# EAGLE design SatUplink-v11 (EAGLE 5.10)
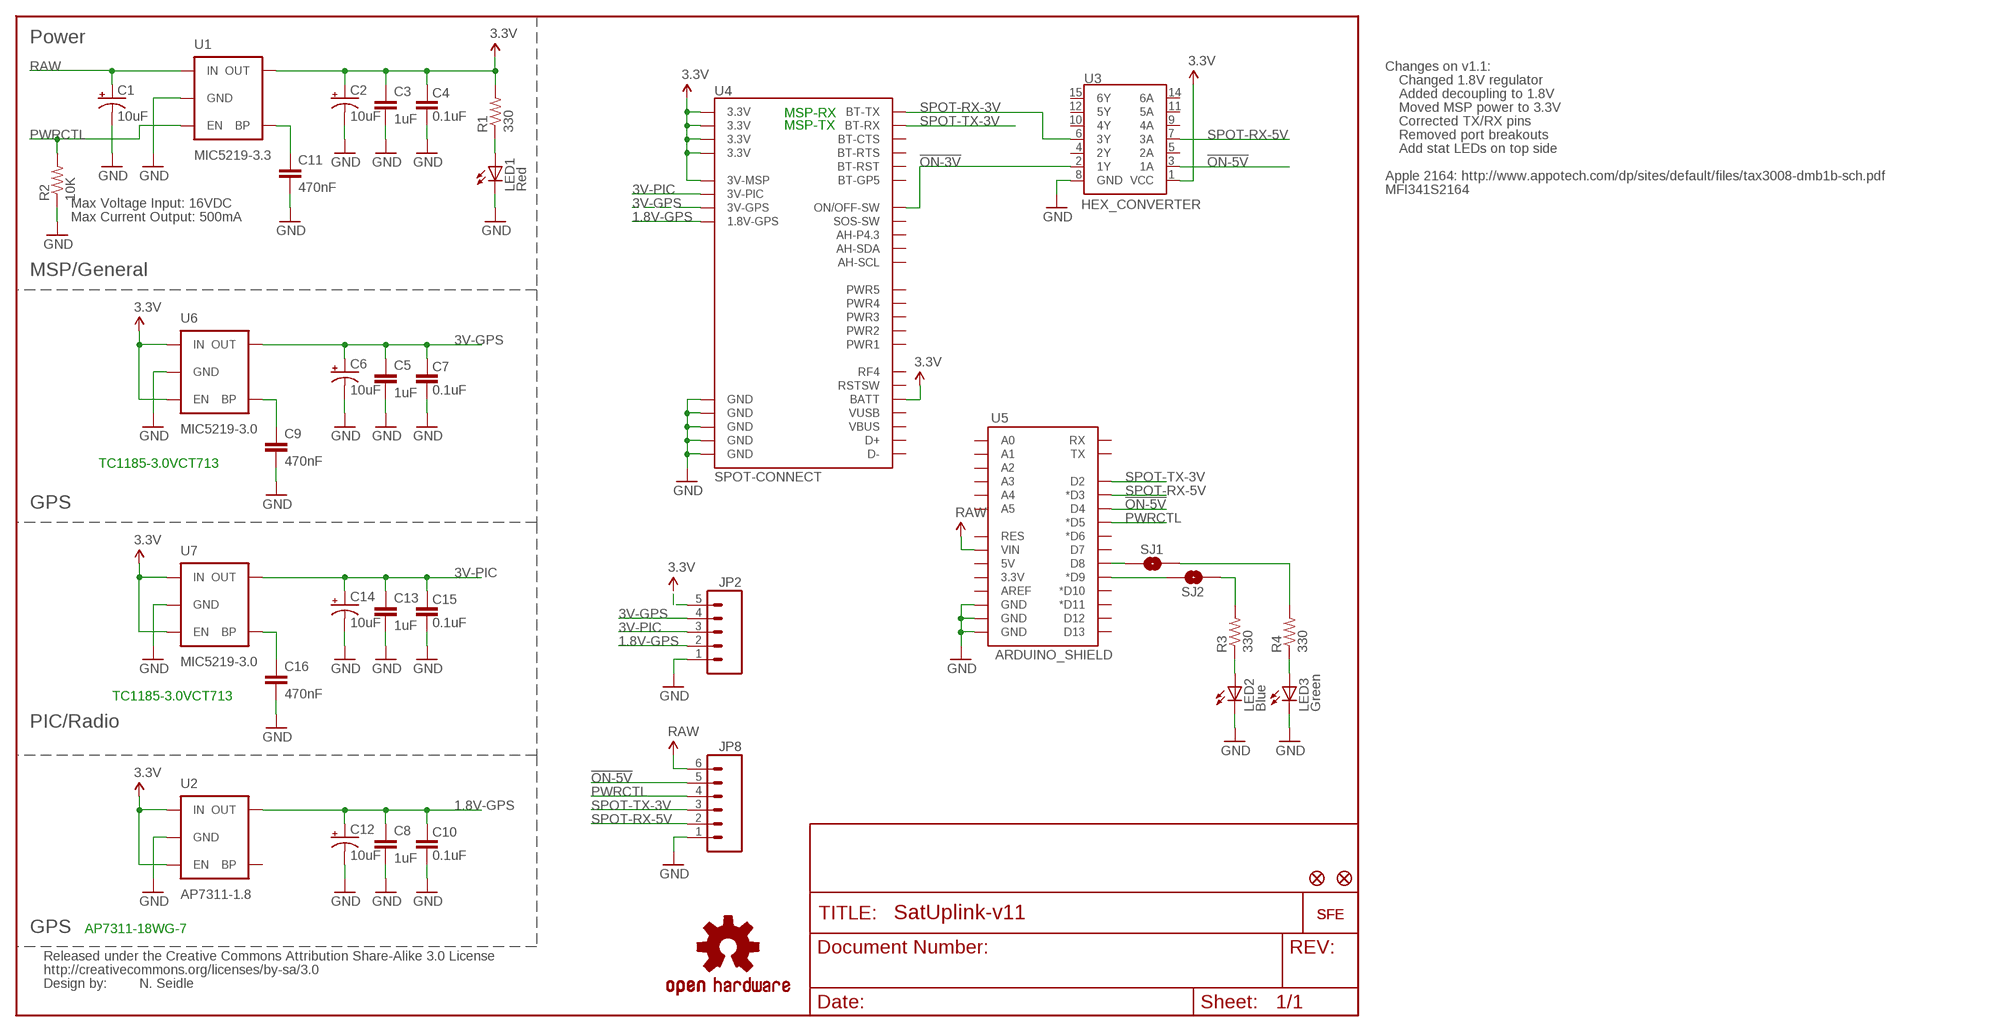
[diagram p0: schematic, sheet 1]

## Parts
C1  10uF  CAP_POL1206  [EIA3216]
C2  10uF  CAP_POL1206  [EIA3216]
C3  1uF  CAP0402-CAP  [0402-CAP]
C4  0.1uF  CAP0402-CAP  [0402-CAP]
C5  1uF  CAP0402-CAP  [0402-CAP]
C6  10uF  CAP_POL1206  [EIA3216]
C7  0.1uF  CAP0402-CAP  [0402-CAP]
C8  1uF  CAP0402-CAP  [0402-CAP]
C9  470nF  CAP0402-CAP  [0402-CAP]
C10  0.1uF  CAP0402-CAP  [0402-CAP]
C11  470nF  CAP0402-CAP  [0402-CAP]
C12  10uF  CAP_POL1206  [EIA3216]
C13  1uF  CAP0402-CAP  [0402-CAP]
C14  10uF  CAP_POL1206  [EIA3216]
C15  0.1uF  CAP0402-CAP  [0402-CAP]
C16  470nF  CAP0402-CAP  [0402-CAP]
JP2  M05PTH  [1X05]
JP8  M06SIP  [1X06]
JP10  FIDUCIALUFIDUCIAL  [MICRO-FIDUCIAL]
JP11  FIDUCIALUFIDUCIAL  [MICRO-FIDUCIAL]
LED1  Red  LED0603  [LED-0603]
LED2  Blue  LED0603  [LED-0603]
LED3  Green  LED0603  [LED-0603]
R1  330  RESISTOR0402-RES  [0402-RES]
R2  10K  RESISTOR0402-RES  [0402-RES]
R3  330  RESISTOR0402-RES  [0402-RES]
R4  330  RESISTOR0402-RES  [0402-RES]
SJ1  SOLDERJUMPERTRACE  [SJ_2S-TRACE]
SJ2  SOLDERJUMPERTRACE  [SJ_2S-TRACE]
U1  MIC5219-3.3  V_REG_LDOSMD  [SOT23-5]
U2  AP7311-1.8  V_REG_LDOSMD  [SOT23-5]
U3  HEX_CONVERTER  [SO016]
U4  SPOT-CONNECT  SPOT-CONNECTSMD  [SPOT-CONNECT]
U5  ARDUINO_SHIELD  ARDUINO_SHIELDNO_SILK  [DUEMILANOVE_VIAS]
U6  MIC5219-3.0  V_REG_LDOSMD  [SOT23-5]
U7  MIC5219-3.0  V_REG_LDOSMD  [SOT23-5]
U$1  LOGO-SFESK  [SFE-LOGO-FLAME]
U$2  CREATIVE_COMMONS  [CREATIVE_COMMONS]
U$3  OSHW-LOGOS  [OSHW-LOGO-S]
U$11  LOGO-SFENEW  [SFE-NEW-WEBLOGO]

## Nets
1.8V-GPS: C8.1 C10.2 C12.A(+) JP2.2 U2.5(OUT) U4.1.8V-GPS
3.3V: C2.A(+) C3.1 C4.2 JP2.5 R1.2 U1.5(OUT) U2.1(IN) U2.3(EN) U3.1(VCC) U4.3.3V@1(3.3V) U4.3.3V@2(3.3V) U4.3.3V@3(3.3V) U4.3.3V@4(3.3V) U4.3VMSP(3V-MSP) U4.BATT U6.1(IN) U6.3(EN) U7.1(IN) U7.3(EN)
3V-GPS: C5.1 C6.A(+) C7.2 JP2.4 U4.3V-GPS U6.5(OUT)
3V-PIC: C13.1 C14.A(+) C15.2 JP2.3 U4.3VPIC(3V-PIC) U7.5(OUT)
!ON-3V: U3.2(1Y) U4.ON/OFF(ON/OFF-SW)
!ON-5V: JP8.5 U3.3(1A) U5.D4
GND [vcc]: C1.C(-) C2.C(-) C3.2 C4.1 C5.2 C6.C(-) C7.1 C8.2 C9.2 C10.1 C11.2 C12.C(-) C13.2 C14.C(-) C15.1 C16.2 JP2.1 JP8.1 LED1.C LED2.C LED3.C R2.1 U1.2(GND) U2.2(GND) U3.8(GND) U4.GND@1(GND) U4.GND@2(GND) U4.GND@3(GND) U4.GND@4(GND) U4.GND@5(GND) U5.GND@0(GND) U5.GND@1(GND) U5.GND@2(GND) U6.2(GND) U7.2(GND)
N$1: C16.1 U7.4(BP)
N$2: R4.2 SJ1.2
N$3: R3.2 SJ2.2
N$4: C9.1 U6.4(BP)
N$5: LED2.A R3.1
N$6: LED3.A R4.1
N$7: SJ1.1 U5.D8
N$8: SJ2.1 U5.D9(*D9)
N$26: C11.1 U1.4(BP)
N$38: LED1.A R1.1
PWRCTL [vcc]: JP8.4 R2.2 U1.3(EN) U5.D5(*D5)
RAW [vcc]: C1.A(+) JP8.6 U1.1(IN) U5.VIN
SPOT-RX-3V: U3.6(3Y) U4.BT-TX
SPOT-RX-5V: JP8.2 U3.7(3A) U5.D3(*D3)
SPOT-TX-3V: JP8.3 U4.BT-RX U5.D2
Unconnected: U2.4(BP) U3.4(2Y) U3.5(2A) U3.9(4A) U3.10(4Y) U3.11(5A) U3.12(5Y) U3.14(6A) U3.15(6Y) U4.AH-SCL U4.AH/P4.3(AH-P4.3) U4.AH/SDA(AH-SDA) U4.BT-CTS U4.BT-GP5 U4.BT-RST U4.BT-RTS U4.D+ U4.D- U4.PWRCTL1(PWR1) U4.PWRCTL2(PWR2) U4.PWRCTL3(PWR3) U4.PWRCTL4(PWR4) U4.PWRCTL5(PWR5) U4.RF4 U4.RSTSW U4.SOS(SOS-SW) U4.VBUS U4.VUSB U5.3.3V U5.5V U5.A0 U5.A1 U5.A2 U5.A3 U5.A4 U5.A5 U5.AREF U5.D6(*D6) U5.D7 U5.D10(*D10) U5.D11(*D11) U5.D12 U5.D13 U5.RES U5.RX U5.TX

## Notes on the sheet
- Power
- Changes on v1.1:
- Changed 1.8V regulator
- Added decoupling to 1.8V
- Moved MSP power to 3.3V
- MSP-RX
- Corrected TX/RX pins
- MSP-TX
- Removed port breakouts
- Add stat LEDs on top side
- Apple 2164: http://www.appotech.com/dp/sites/default/files/tax3008-dmb1b-sch.pdf
- MFI341S2164
- Max Voltage Input: 16VDC
- Max Current Output: 500mA
- MSP/General
- TC1185-3.0VCT713
- GPS
- TC1185-3.0VCT713
- PIC/Radio
- GPS | AP7311-18WG-7
- N. Seidle

## Library data of the parts
C1 C2 C6 C12 C14 = SparkFun:CAP_POL: Capacitor Polarized These are standard SMD and PTH capacitors. Normally 10uF, 47uF, and 100uF in electrolytic and tantalum varieties. Always verify the external diameter of the through hole cap, it varies with capacity, voltage, and manufacturer. The EIA devices should be standard.
C3-C5 C7-C11 C13 C15 C16 = SparkFun:CAP: Capacitor Standard 0603 ceramic capacitor, and 0.1" leaded capacitor.
JP2 = SparkFun:M05: Header 5 Standard 5-pin 0.1" header. Use with straight break away headers (SKU : PRT-00116), right angle break away headers (PRT-00553), swiss pins (PRT-00743), machine pins (PRT-00117), and female headers (PRT-00115). Molex polarized connector foot print use with SKU : PRT-08230 with associated crimp pins and housings.
JP8 = SparkFun:M06: Header 6 Standard 6-pin 0.1" header. Use with straight break away headers (SKU : PRT-00116), right angle break away headers (PRT-00553), swiss pins (PRT-00743), machine pins (PRT-00117), and female headers (PRT-00115). Molex polarized connector foot print use with SKU : PRT-08094 with associated crimp pins and housings. NOTES ON THE VARIANTS LOCK and LOCK_LONGPADS... This footprint was designed to help hold the alignment of a through-hole component (i.e. 6-pin header) while soldering it into place. You may notice that each hole has been shifted either up or down by 0.005 of an inch from it's more standard position (which is a perfectly straight line). This slight alteration caused the pins (the squares in the middle) to touch the edges of the holes. Because they are alternating, it causes a "brace" to hold the component in place. 0.005 has proven to be the perfect amount of "off-center" position when using our standard breakaway headers. Although looks a little odd when you look at the bare footprint, once you have a header in there, the alteration is very hard to notice. Also, if you push a header all the way into place, it is covered up entirely on the bottom side. This idea of altering the position of holes to aid alignment will be further integrated into the Sparkfun Library for other footprints. It can help hold any component with 3 or more connection pins.
JP10 JP11 = SparkFun:FIDUCIAL: Fiducial Alignment Points Various fiducial points for machine vision alignment.
LED1-LED3 = SparkFun:LED: LEDs Standard schematic elements and footprints for 5mm, 3mm, 1206, and 0603 sized LEDs. 5mm - Spark Fun Electronics SKU : COM-00529 (and others)
R1-R4 = SparkFun:RESISTOR: Resistor Basic schematic elements and footprints for 0603, 1206, and PTH resistors.
SJ1 SJ2 = SparkFun:SOLDERJUMPER: Solder Jumper Standard SMD solder jumper. Used to automate production. Two varients : Normally Open and Normally Closed are the same, but have different paste layers. NC will have a large amount of paste and should jumper during reflow.
U1 U2 U6 U7 = SparkFun:V_REG_LDO: Voltage Regulator LDO Standard 150mA LDO voltage regulator in SOT-23 layout. Micrel part MIC5205. BP (by-pass) pin is used to lower output noise with 470pF cap.
U3 = SparkFun:HEX_CONVERTER
U4 = SparkFun:SPOT-CONNECT
U5 = SparkFun:ARDUINO_SHIELD
U$1 U$11 = SparkFun:LOGO-SFE: Spark Fun Electronics PCB Logo This is the standard Spark Fun Electronics PCB logo.
U$2 = SparkFun:CREATIVE_COMMONS
U$3 = SparkFun:OSHW-LOGO: Open Source Hardware Logo This logo indicates the piece of hardware it is found on incorporates a OSHW license and/or adheres to the definition of open source hardware found here: http://freedomdefined.org/OSHW

## Net classes
0 default: width 0.203 mm

## Board
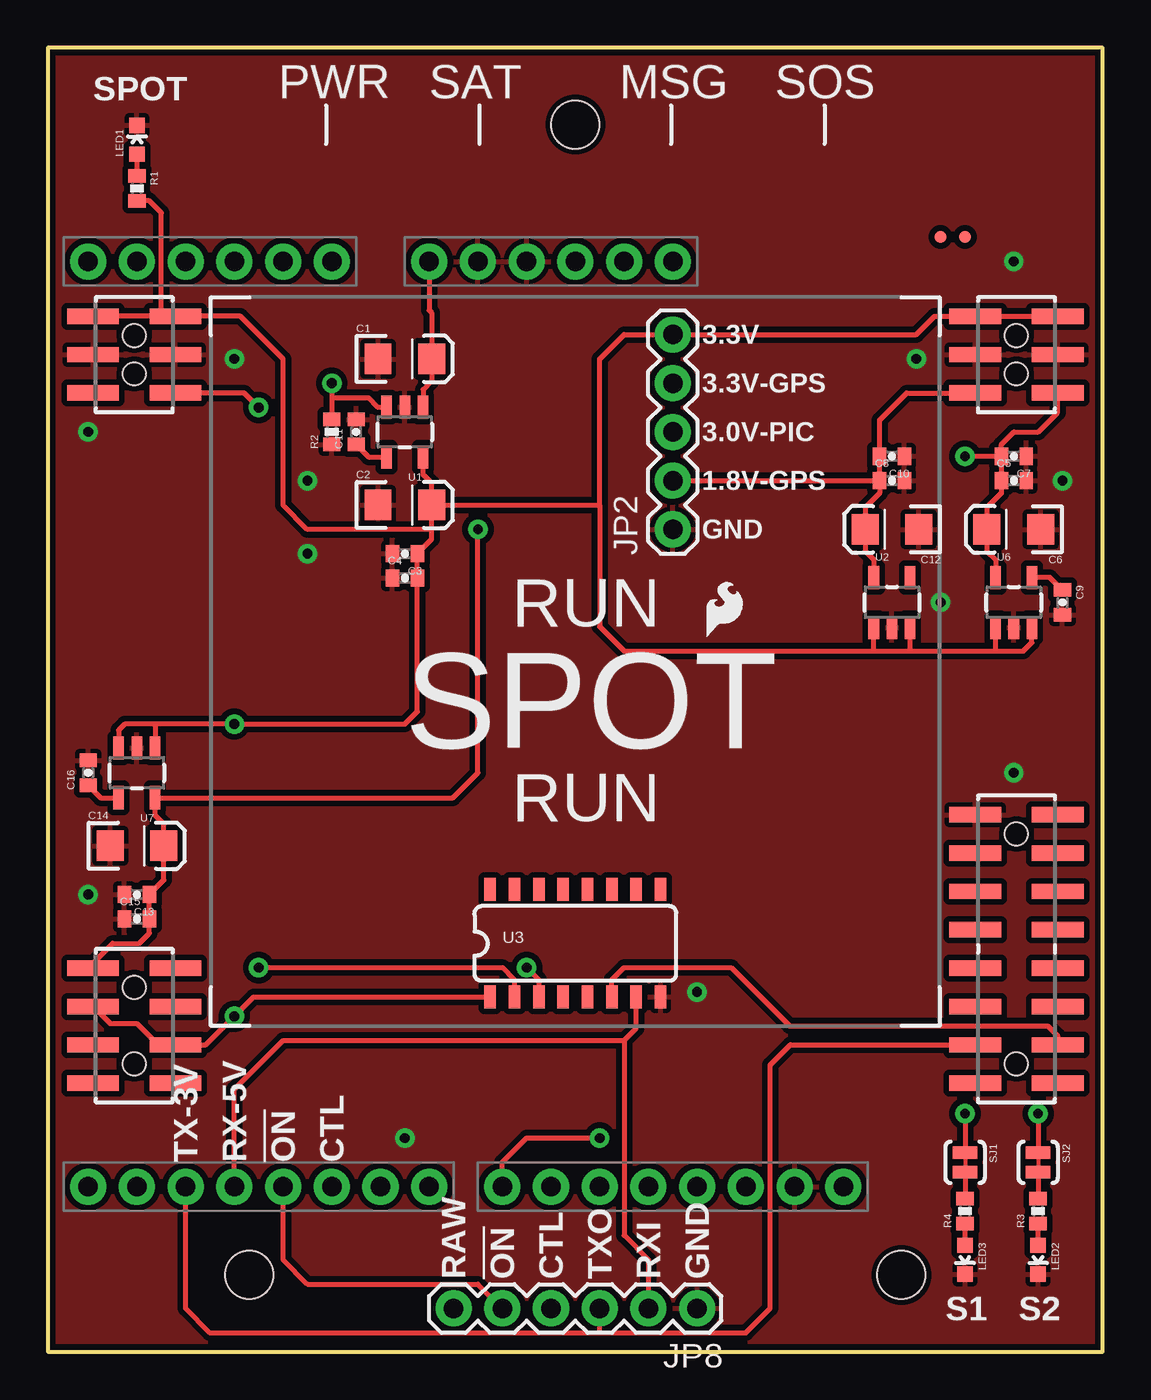
[diagram p1: board, top side]
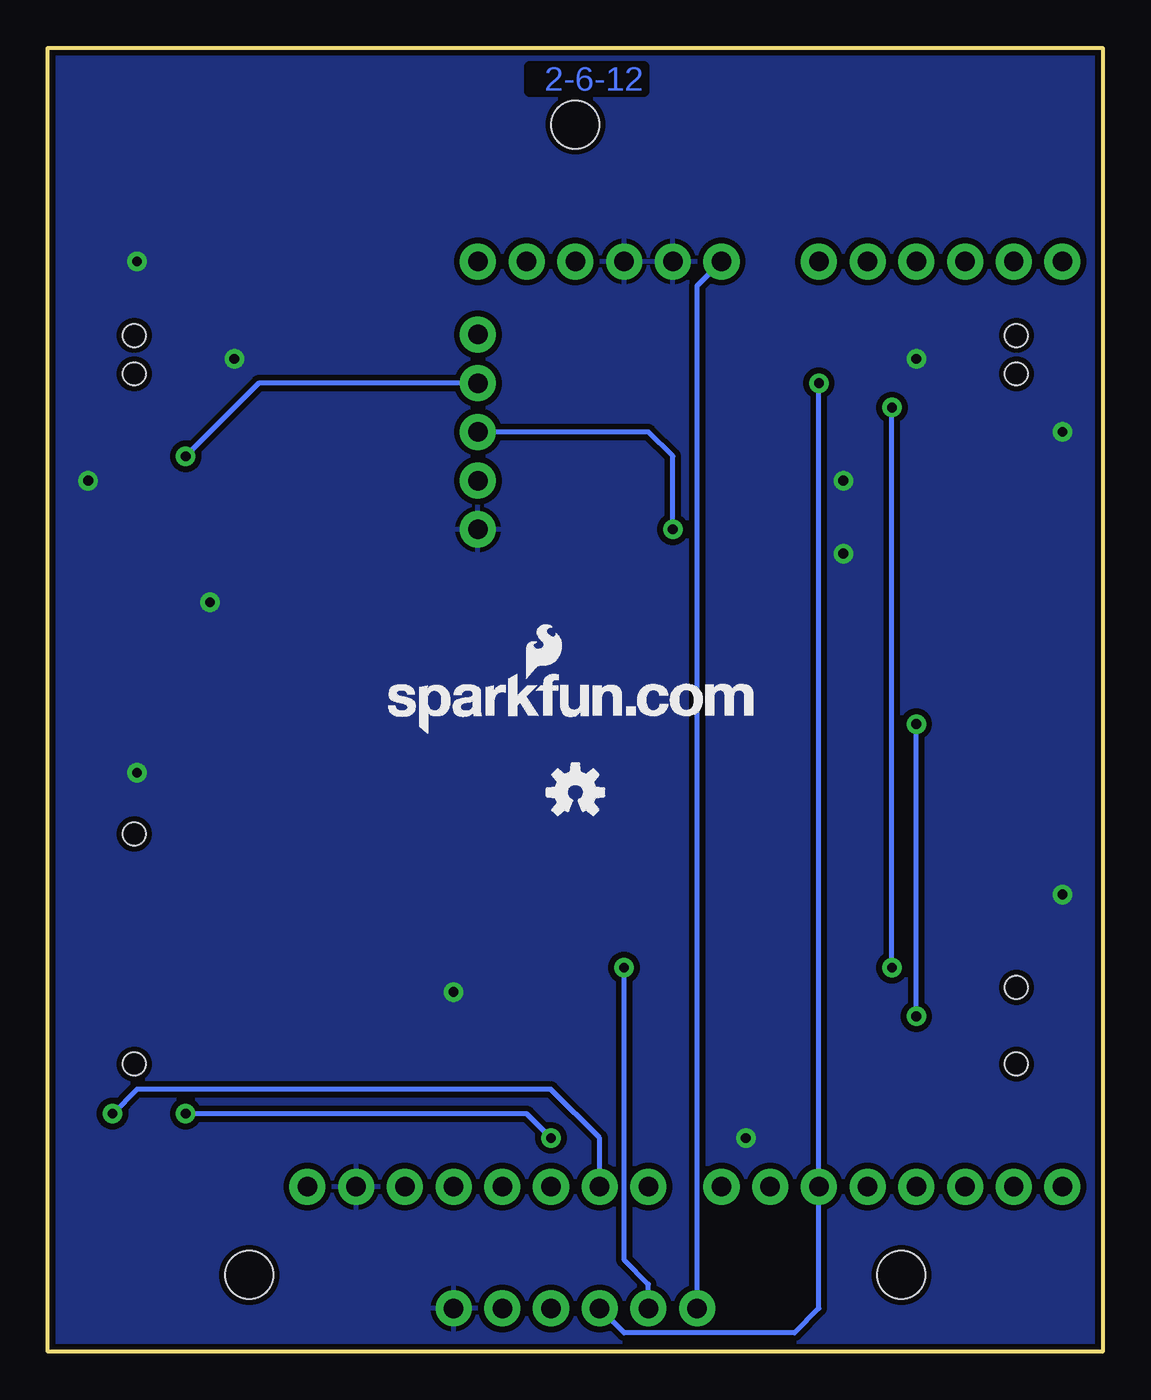
[diagram p2: board, bottom side, seen from below]

Size 55 x 68 mm. Coordinates in mm from the lower left corner, seen from the top.
Copper layers (1*16): Top 0.035mm / dielectric 1.5mm / Bottom 0.035mm
Design rules "SparkFun *": minimum track width 8mil, minimum drill 20mil, track to track 8mil, track to pad 8mil, pad to pad 8mil, via to via 8mil, smd to smd 8mil, copper to edge 10mil, drill to drill 8mil, minimum pad ring 12mil, minimum via ring 10mil, stop-mask expansion 4mil, vias tented up to drill 20mil, thermal gap 10mil

### Footprints (pad centres in the part's own frame; a part is rotated, then mirrored left to right if it is on the bottom)
EIA3216 = smd 1.4 x 1.6: A 1.4,0; C -1.4,0
0402-CAP = smd 0.7 x 0.9: 1 -0.65,0; 2 0.65,0
1X05 = drill 1.016 pad 1.88 round: 1 0,0; 2 2.54,0; 3 5.08,0; 4 7.62,0; 5 10.16,0
1X06 = drill 1.016 pad 1.88 round: 1 0,0; 2 2.54,0; 3 5.08,0; 4 7.62,0; 5 10.16,0; 6 12.7,0
MICRO-FIDUCIAL = smd 0.635 x 0.635: 1 0,0
LED-0603 = smd 0.8 x 0.8: A 0,-0.75; C 0,0.75
0402-RES = smd 0.7 x 0.9: 1 -0.65,0; 2 0.65,0
SJ_2S-TRACE = smd 0.635 x 1.27: 1 -0.508,0; 2 0.508,0
SOT23-5 = smd 0.55 x 1.2: 1 -0.95,-1.3; 2 0,-1.3; 3 0.95,-1.3; 4 0.95,1.3; 5 -0.95,1.3
SO016 = smd 0.6 x 1.2: 1 -4.445,-2.8; 2 -3.175,-2.8; 3 -1.905,-2.8; 4 -0.635,-2.8; 5 0.635,-2.8; 6 1.905,-2.8; 7 3.175,-2.8; 8 4.445,-2.8; 9 4.445,2.8; 10 3.175,2.8; 11 1.905,2.8; 12 0.635,2.8; 13 -0.635,2.8; 14 -1.905,2.8; 15 -3.175,2.8; 16 -4.445,2.8
SPOT-CONNECT = smd 2.7 x 0.8: 1.8V-GPS 20.85,16; 3.3V@1 -25.15,20; 3.3V@2 -20.85,20; 3.3V@3 20.85,20; 3.3V@4 25.15,20; 3V-GPS 25.15,16; 3VMSP -25.15,-16; 3VPIC -25.15,-14; AH-SCL 25.15,-12; AH/P4.3 20.85,-14; AH/SDA 20.85,-12; BATT -20.85,-18; BT-CTS 20.85,-16; BT-GP5 25.15,-16; BT-RST 25.15,-14; BT-RTS 20.85,-20; BT-RX 20.85,-18; BT-TX 25.15,-18; D+ -20.85,-20; D- -25.15,-20; GND@1 -25.15,18; GND@2 -20.85,18; GND@3 20.85,18; GND@4 25.15,18; GND@5 20.85,-6; ON/OFF -20.85,16; PWRCTL1 25.15,-10; PWRCTL2 25.15,-8; PWRCTL3 25.15,-6; PWRCTL4 20.85,-10; PWRCTL5 20.85,-8; RF4 -20.85,-14; RSTSW -25.15,-18; SOS -25.15,16; VBUS 25.15,-20; VUSB -20.85,-16 | hole 2.5: 0,30; 17,-30; -17,-30 | hole 1.2: 23,-19; 23,-7; -23,-15; -23,-19; -23,17; -23,19; 23,17; 23,19
DUEMILANOVE_VIAS = drill 1.016 pad 1.88 round: 3.3V 50.8,13.97; 5V 50.8,16.51; A0 50.8,29.21; A1 50.8,31.75; A2 50.8,34.29; A3 50.8,36.83; A4 50.8,39.37; A5 50.8,41.91; AREF 2.54,2.54; D2 2.54,36.83; D3 2.54,34.29; D4 2.54,31.75; D5 2.54,29.21; D6 2.54,26.67; D7 2.54,24.13; D8 2.54,20.32; D9 2.54,17.78; D10 2.54,15.24; D11 2.54,12.7; D12 2.54,10.16; D13 2.54,7.62; GND@0 50.8,19.05; GND@1 50.8,21.59; GND@2 2.54,5.08; RES 50.8,11.43; RX 2.54,41.91; TX 2.54,39.37; VIN 50.8,24.13

### Placement (x,y rotation side)
C1  18.61,51.78 0 top
C2  18.61,44.16 0 top
C3  18.61,41.62 180 top
C4  18.61,40.35 0 top
C5  50.36,45.43 0 top
C6  50.36,42.89 180 top
C7  50.36,46.7 180 top
C8  44.01,45.43 0 top
C9  52.9,39.08 270 top
C10  44.01,46.7 180 top
C11  16.07,47.97 90 top
C12  44.01,42.89 180 top
C13  4.64,23.84 180 top
C14  4.64,26.38 0 top
C15  4.64,22.57 0 top
C16  2.1,30.19 90 top
JP2  32.58,42.89 90 top
JP8  33.85,2.25 180 top
JP10  47.82,58.13 90 top
JP11  46.55,58.13 90 top
LED1  4.64,63.21 0 top
LED2  51.63,4.79 180 top
LED3  47.82,4.79 180 top
R1  4.64,60.67 270 top
R2  14.8,47.97 90 top
R3  51.63,7.33 90 top
R4  47.82,7.33 90 top
SJ1  47.82,9.87 270 top
SJ2  51.63,9.87 270 top
U1  18.61,47.97 180 top
U2  44.01,39.08 0 top
U3  27.5,21.3 0 top
U4  27.5,34 0 top
U5  44.01,6.06 90 top
U6  50.36,39.08 0 top
U7  4.64,30.19 180 top
U$1  34.36,37.3 0 top
U$2  -4.25,-10.45 0 top  (outside the outline)
U$3  27.5,29.17 0 bottom
U$11  37.28,32.22 0 bottom

### Tracks (layer width: path | path; a pad name or v marks a point on that pad's centre or on a via)
1.8V-GPS
  Top 0.254: C8.1 C10.2 43.36,48.59 44.77,50 U4.1.8V-GPS | C8.1 43.36,44.78 42.61,44.03 C12.A 42.61,41.75 43.06,41.3 U2.5 | JP2.2 C8.1
3.3V  (via drill 0.51)
  Top 0.254: U7.3 3.69,32.41 4,32.73 5.53,32.73 | U7.1 5.59,32.67 5.53,32.73 | U4.3VMSP 3.24,17.11 4.64,17.11 5.75,16 U4.BATT 8.23,16 v9.72,17.49 10.73,18.5 U3.1 | 20.01,42.89 20.01,42.37 C3.1 C4.2 19.26,33.38 18.61,32.73 v9.72,32.73 5.53,32.73 | 20.01,42.89 C2.A | U1.5 19.56,45.75 20.01,45.3 C2.A | U6.3 51.31,36.98 50.87,36.54 49.34,36.54 | 43.12,36.54 45.03,36.54 | 45.03,36.54 49.34,36.54 | U2.1 43.06,36.6 43.12,36.54 | U2.3 44.96,36.61 45.03,36.54 | U6.1 49.41,36.61 49.34,36.54 | U4.3.3V@4 U4.3.3V@3 46.23,54 45.28,53.05 JP2.5 30.04,53.05 28.77,51.78 28.77,44.16 | C2.A 28.77,44.16 | 43.12,36.54 30.04,36.54 28.77,37.81 28.77,44.16 | 5.91,54 U4.3.3V@2 10.04,54 12.26,51.78 12.26,44.16 13.53,42.89 20.01,42.89 | 5.91,54 U4.3.3V@1 | R1.2 5.29,60.02 5.91,59.4 5.91,54
  Bottom 0.254: v9.72,17.49 v9.72,32.73
3V-GPS  (via drill 0.51)
  Top 0.254: C7.2 C5.1 49.71,44.78 48.96,44.03 C6.A 48.96,41.75 49.41,41.3 U6.5 | C7.2 49.71,47.32 50.36,47.97 51.63,47.97 52.65,48.99 U4.3V-GPS | v47.82,46.7 C7.2
  Bottom 0.254: JP2.4 44.01,50.51 v47.82,46.7
3V-PIC  (via drill 0.51)
  Top 0.254: U4.3VPIC 2.35,20.28 3.37,21.3 4.77,21.3 5.29,21.82 C15.2 C13.1 6.04,24.59 C14.A 6.04,27.52 5.59,27.97 U7.5 21.12,28.89 22.42,30.19 v22.42,42.89
  Bottom 0.254: v22.42,42.89 22.42,46.7 23.69,47.97 JP2.3
!ON-3V  (via drill 0.51)
  Top 0.254: U3.2 24.32,19.39 23.69,20.03 v10.99,20.03 | U4.ON/OFF 10.23,50 v10.99,49.24
  Bottom 0.254: v10.99,20.03 v10.99,49.24
!ON-5V  (via drill 0.51)
  Top 0.254: U5.D4 12.26,4.79 13.53,3.52 22.42,3.52 JP8.5 | U3.3 25.59,19.39 v24.96,20.03
  Bottom 0.254: JP8.5 23.69,3.52 24.96,4.79 v24.96,20.03
GND  (via drill 0.51)
  other vias: 13.53,45.43 13.53,41.62 2.1,47.97 2.1,23.84 33.85,18.76 50.36,30.19 46.55,39.08 52.9,45.43 45.28,51.78 50.36,56.86 9.72,51.78 18.61,11.14
  pour Top (isolate 0.305): -0.44,-0.29 -0.44,68.29 55.44,68.29 55.44,-0.29
  pour Bottom (isolate 0.305): -0.44,-0.29 -0.44,68.29 55.44,68.29 55.44,-0.29
N$1
  Top 0.254: U7.4 2.75,28.89 C16.1
N$2
  Top 0.254: SJ1.2 R4.2
N$3
  Top 0.254: SJ2.2 R3.2
N$4
  Top 0.254: U6.4 52.25,40.38 C9.1
N$5
  Top 0.254: LED2.A R3.1
N$6
  Top 0.254: LED3.A R4.1
N$7  (via drill 0.51)
  Top 0.254: U5.D8 23.69,9.87 24.96,11.14 v28.77,11.14 | v47.82,12.41 SJ1.1
  Bottom 0.254: v28.77,11.14 30.04,12.41 v47.82,12.41
N$8  (via drill 0.51)
  Top 0.254: v51.63,12.41 SJ2.1
  Bottom 0.254: U5.D9 26.23,11.14 28.77,13.68 50.36,13.68 v51.63,12.41
N$26
  Top 0.254: U1.4 16.72,46.67 C11.1
N$38
  Top 0.254: LED1.A R1.1
PWRCTL  (via drill 0.51)
  Top 0.254: v14.8,50.51 14.8,49.75 | 14.8,49.75 R2.2 | U1.3 17.18,49.27 16.7,49.75 14.8,49.75
  Bottom 0.254: v14.8,50.51 U5.D5 14.8,2.25 16.07,0.98 24.96,0.98 JP8.4
RAW
  Top 0.254: U1.1 19.56,50.19 20.01,50.64 C1.A 20.01,54.19 19.88,54.32 U5.VIN
  Bottom 0.254: JP8.6 21.15,55.59 U5.VIN
SPOT-RX-3V
  Top 0.254: U3.6 29.4,19.39 30.04,20.03 35.63,20.03 38.68,16.98 52.14,16.98 52.65,16.47 U4.BT-TX
SPOT-RX-5V
  Top 0.254: JP8.2 31.31,4.79 30.04,6.06 30.04,16.22 | U5.D3 9.72,13.68 12.26,16.22 30.04,16.22 | U3.7 30.67,16.86 30.04,16.22
SPOT-TX-3V
  Top 0.254: U5.D2 7.18,2.25 8.45,0.98 28.77,0.98 | U4.BT-RX 38.71,16 37.66,14.95 37.66,2.25 36.39,0.98 28.77,0.98 | 28.77,0.98 JP8.3

### Text on the board
Bottom: 2-6-12
tPlace: SPOT | 3.3V | 3.3V-GPS | 3.0V-PIC | 1.8V-GPS | GND | TX-3V | RX-5V | !ON | CTL | RAW | !ON | CTL | TXO | RXI | GND | S1 | S2 | N. Seidle